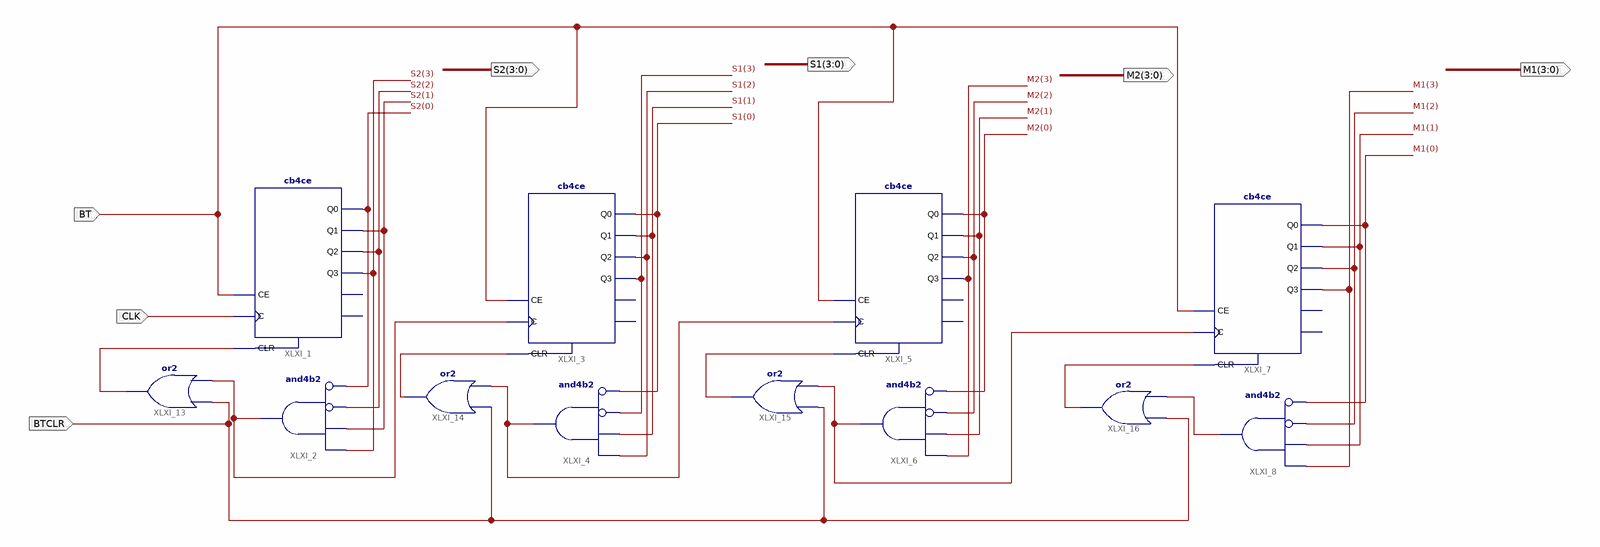
[diagram p0: schematic sheet 1]
// Xilinx ISE schematic MM_SS.sch (spartan6) as structural Verilog: 12 symbols, 7 ports
module MM_SS (
  input  CLK,
  input  BTCLR,
  input  BT,
  output [3:0] S2,
  output [3:0] S1,
  output [3:0] M2,
  output [3:0] M1
);

  wire XLXN_25, XLXN_34, XLXN_39, XLXN_40, XLXN_67, XLXN_68, XLXN_69, XLXN_70;

  cb4ce XLXI_1 (.C(CLK), .CE(BT), .CLR(XLXN_67), .Q0(S2[0]), .Q1(S2[1]), .Q2(S2[2]), .Q3(S2[3]));  // open: CEO, TC
  and XLXI_2 (XLXN_39, ~S2[0], ~S2[2], S2[1], S2[3]);  // and4b2
  and XLXI_4 (XLXN_40, ~S1[0], ~S1[3], S1[1], S1[2]);  // and4b2
  and XLXI_6 (XLXN_25, ~M2[0], ~M2[2], M2[1], M2[3]);  // and4b2
  and XLXI_8 (XLXN_34, ~M1[0], ~M1[2], M1[1], M1[3]);  // and4b2
  or XLXI_13 (XLXN_67, XLXN_39, BTCLR);
  or XLXI_14 (XLXN_68, XLXN_40, BTCLR);
  or XLXI_15 (XLXN_69, XLXN_25, BTCLR);
  or XLXI_16 (XLXN_70, XLXN_34, BTCLR);
  cb4ce XLXI_5 (.C(XLXN_40), .CE(BT), .CLR(XLXN_69), .Q0(M2[0]), .Q1(M2[1]), .Q2(M2[2]), .Q3(M2[3]));  // open: CEO, TC
  cb4ce XLXI_7 (.C(XLXN_25), .CE(BT), .CLR(XLXN_70), .Q0(M1[0]), .Q1(M1[1]), .Q2(M1[2]), .Q3(M1[3]));  // open: CEO, TC
  cb4ce XLXI_3 (.C(XLXN_39), .CE(BT), .CLR(XLXN_68), .Q0(S1[0]), .Q1(S1[1]), .Q2(S1[2]), .Q3(S1[3]));  // open: CEO, TC
endmodule
